# Altium schematic sheet 1000374_ChangeLog.SchDoc: see variant params
size Tabloid; CompanyName: Synapse Wireless Inc.; DrawnBy: <name>; Engineer: <name>; Address1: 6723 Odyssey Drive; Address2: Huntsville, AL 35806; Revision: see variant parameters; SheetNumber: 2; SheetTotal: 2; DocumentTitle: see variant params; SchematicNumber: see variant parameters; AssemblyName: see variant parameters; PCBArevision: see variant parameters
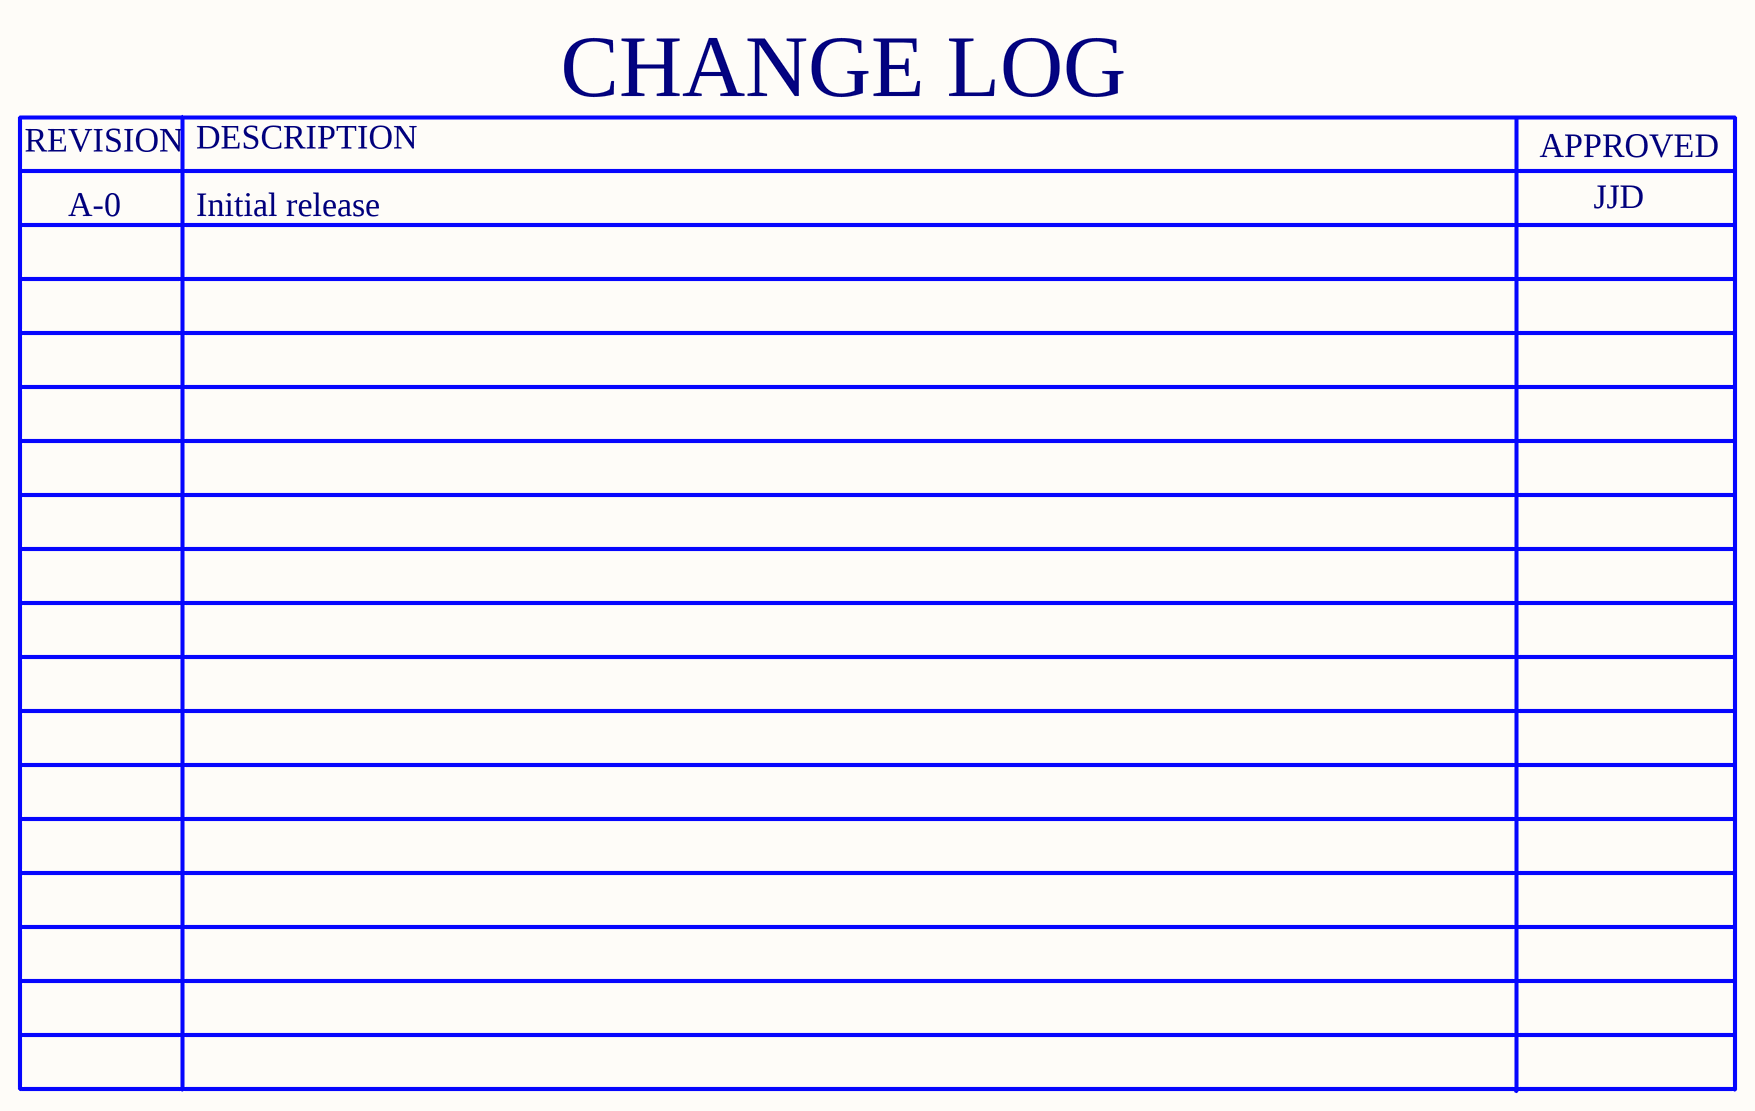
[diagram p0: 1000374_ChangeLog.SchDoc]

## Notes on the sheet
- REVISION
- DESCRIPTION
- CHANGE LOG
- A-0
- Initial release
- APPROVED
- JJD
- This document contains proprietary information and such information
- PROPRIETARY NOTICE
- may not be disclosed to others for any purpose or used for
- manufacturing purposes without written permission from Synapse
- Wireless Inc.
- The United States Government and other recipients shall not be
- bound by this restriction to the extent they have by written contract
- Synapse Wireless Inc.
- 6723 Odyssey Drive
- Huntsville, AL
- 35806
- acquired greater rights.
- 256-852-7888